# EAGLE design fusesBoard (EAGLE 7.6.0)
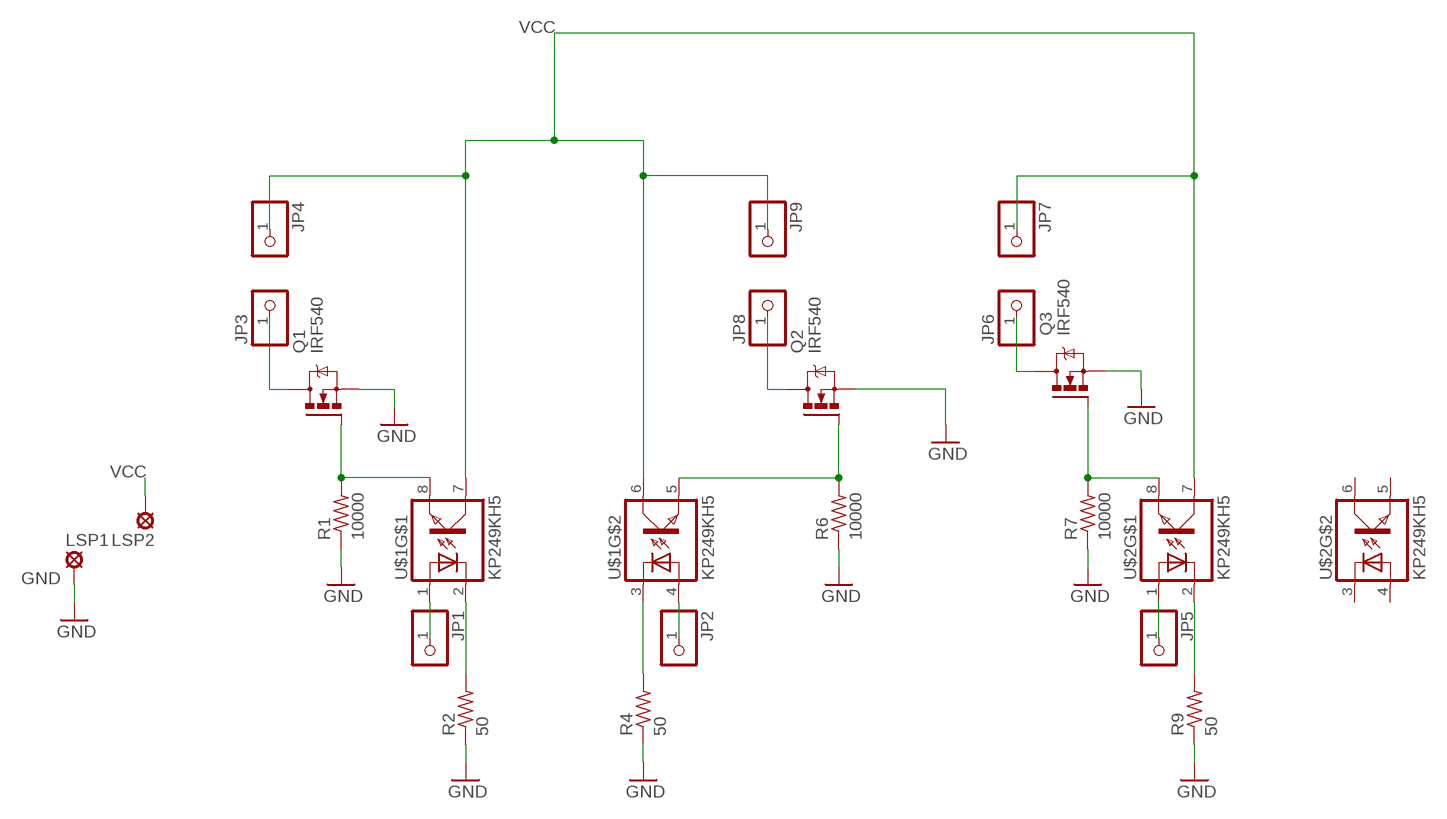
[diagram p0: schematic, sheet 1]

## Parts
JP1  PINHD-1X1  [1X01]
JP2  PINHD-1X1  [1X01]
JP3  PINHD-1X1  [1X01]
JP4  PINHD-1X1  [1X01]
JP5  PINHD-1X1  [1X01]
JP6  PINHD-1X1  [1X01]
JP7  PINHD-1X1  [1X01]
JP8  PINHD-1X1  [1X01]
JP9  PINHD-1X1  [1X01]
LSP1  SE14  [SE14]
LSP2  SE14  [SE14]
Q1  IRF540  [TO220BV]
Q2  IRF540  [TO220BV]
Q3  IRF540  [TO220BV]
R1  10000  R-US_0204/7  [0204/7]
R2  50  R-US_0204/7  [0204/7]
R4  50  R-US_0204/7  [0204/7]
R6  10000  R-US_0204/7  [0204/7]
R7  10000  R-US_0204/7  [0204/7]
R9  50  R-US_0204/7  [0204/7]
U$1  KP249KH5  [DIL08]
U$2  KP249KH5  [DIL08]

## Nets
CTRL1: JP1.1 U$1.1
CTRL2: JP2.1 U$1.4
CTRL3: JP5.1 U$2.1
GATE1: Q1.G R1.2 U$1.8
GATE2: Q2.G R6.2 U$1.5
GATE3: Q3.G R7.2 U$2.8
GND: LSP1.MP Q1.S Q2.S Q3.S R1.1 R2.1 R4.1 R6.1 R7.1 R9.1
N$17: R2.2 U$1.2
N$18: R9.2 U$2.2
N$26: R4.2 U$1.3
SOURCE1: JP3.1 Q1.D
SOURCE2: JP8.1 Q2.D
SOURCE3: JP6.1 Q3.D
VCC: JP4.1 JP7.1 JP9.1 LSP2.MP U$1.6 U$1.7 U$2.7
Unconnected: U$2.3 U$2.4 U$2.5 U$2.6

## Library data of the parts
JP1-JP9 = pinhead:PINHD-1X1: PIN HEADER
LSP1 LSP2 = solpad:SE14: SOLDER PAD E1553, drill 1,4mm, distributor Buerklin, 07F820
Q1-Q3 = transistor-power:IRF540: HEXFET Power MOSFET
R1 R2 R4 R6 R7 R9 = resistor:R-US_: RESISTOR, American symbol
U$1 U$2 = optron1:KP249KH5

## Board
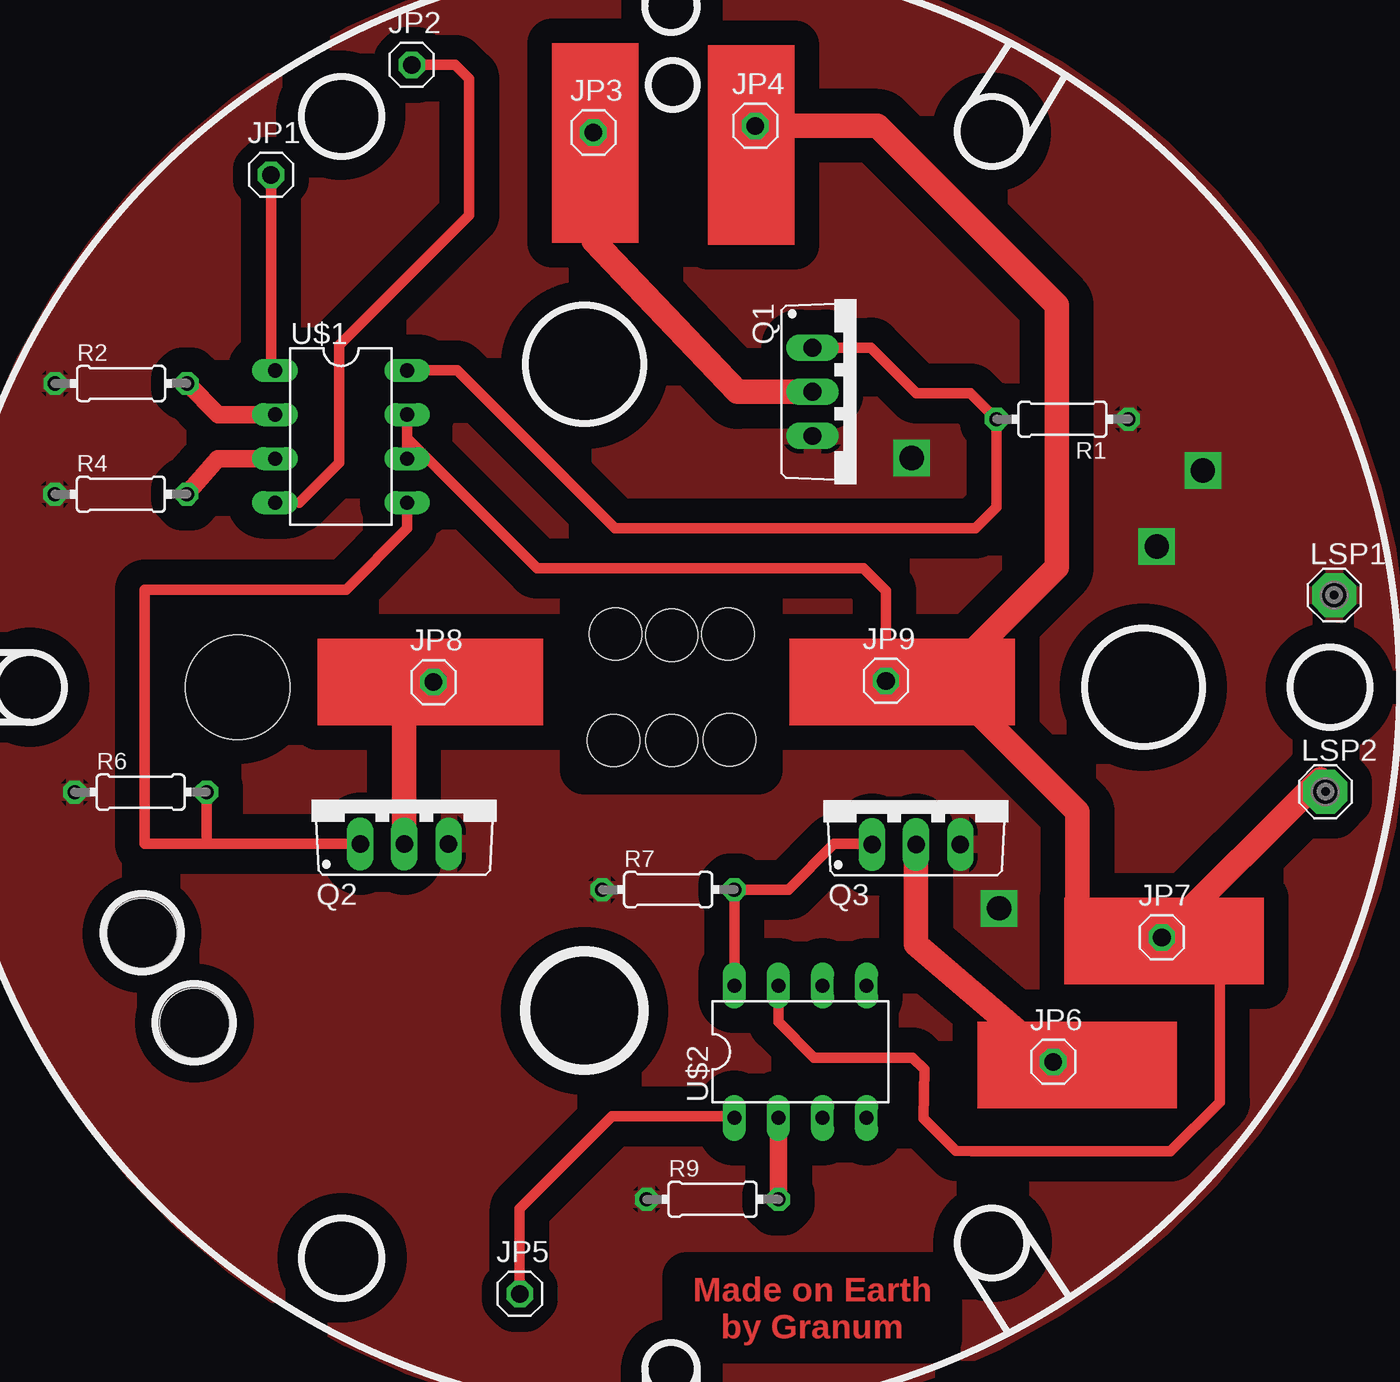
[diagram p1: board, top side]
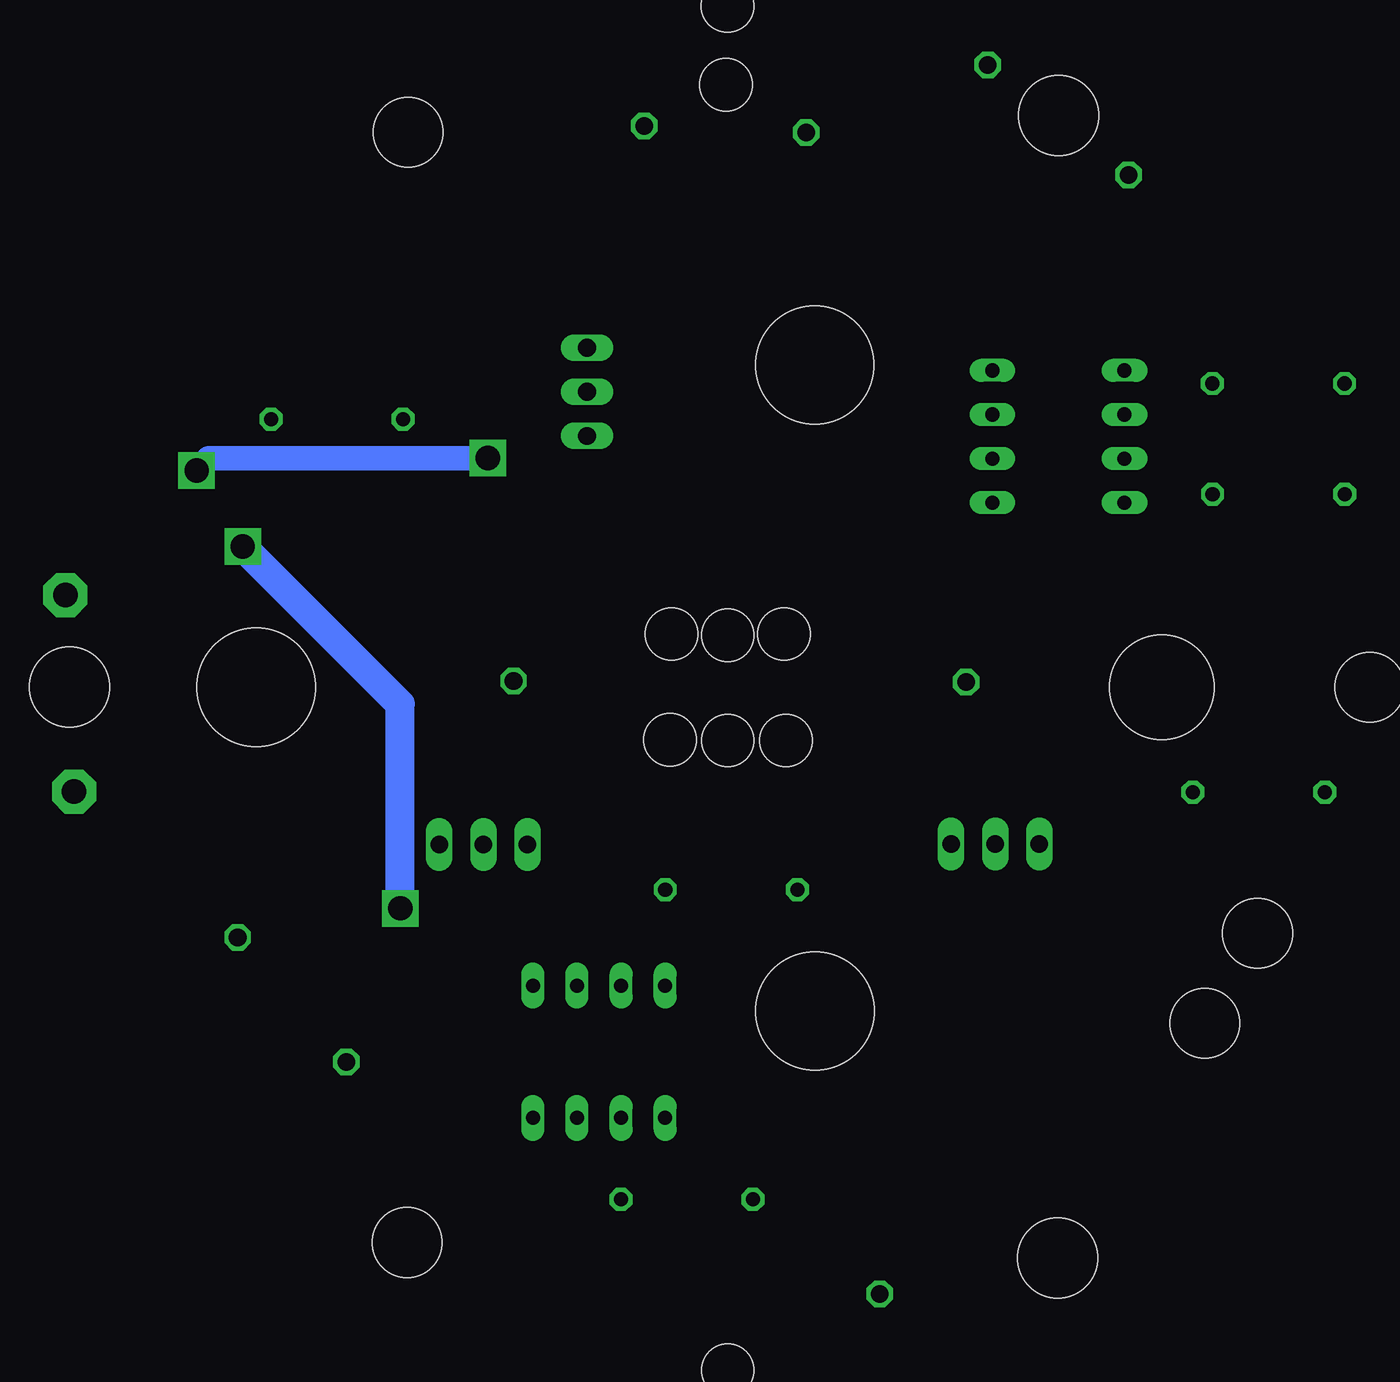
[diagram p2: board, bottom side, seen from below]

No outline drawn. Coordinates in mm, seen from the top.
Copper layers (1*16): Top 0.035mm / dielectric 1.5mm / Bottom 0.035mm
Design rules "default": minimum track width 10mil, minimum drill 24mil, track to track 8mil, track to pad 8mil, pad to pad 8mil, via to via 8mil, smd to smd 8mil, copper to edge 40mil, drill to drill 8mil, minimum pad ring 10mil, minimum via ring 8mil, stop-mask expansion 4mil, vias tented up to drill 0mil, thermal gap 10mil
Holes 6 mm at 20.01,40.12
Holes 6.8 mm at 40.03,58.69 72.25,40.11 40.01,21.45
Holes 4 mm at 8.02,40.12 63.48,72.11 63.55,8.1 14.49,25.92 17.52,20.75
Holes 4.6 mm at 25.95,73.09 83.02,40.12 26.03,7.22
Holes 3 mm at 45.04,0.74 45.06,79.39 45.14,74.86 41.8,43.19 48.29,43.19 41.68,37.05 48.37,37.09 45.04,37.05 45.04,43.11
tRestrict: area 40,41.4 to 50,44.9; area 40,35.4 to 50,38.9; area 43.9,66 to 46.4,81.8

### Footprints (pad centres in the part's own frame; a part is rotated, then mirrored left to right if it is on the bottom)
1X01 = drill 1.016 octagon: 1 0,0
SE14 = drill 1.397 pad 2.54 octagon: MP 0,0
TO220BV = drill 1.016 long: D 0,-2.54; G -2.54,-2.54; S 2.54,-2.54
0204/7 = drill 0.813 octagon: 1 -3.81,0; 2 3.81,0
DIL08 = drill 0.813 long: 1 -3.81,-3.81; 2 -1.27,-3.81; 3 1.27,-3.81; 4 3.81,-3.81; 5 3.81,3.81; 6 1.27,3.81; 7 -1.27,3.81; 8 -3.81,3.81

### Placement (x,y rotation side)
JP1  21.93,69.66 0 top
JP2  30.05,76 0 top
JP3  40.53,72.1 0 top
JP4  49.87,72.48 0 top
JP5  36.28,5.14 0 top
JP6  67.05,18.51 0 top
JP7  73.31,25.69 0 top
JP8  31.3,40.41 0 top
JP9  57.4,40.48 0 top
LSP1  83.25,45.43 0 top
LSP2  82.75,34.1 0 top
Q1  55.7,57.15 270 top
Q2  29.62,33.62 0 top
Q3  59.14,33.59 0 top
R1  67.58,55.57 180 top
R2  13.28,57.63 0 top
R4  13.27,51.24 0 top
R6  14.41,34.07 0 top
R7  44.84,28.45 0 top
R9  47.4,10.59 0 top
U$1  25.97,54.57 270 top
U$2  52.47,19.1 0 top

### Tracks (layer width: path | path; a pad name or v marks a point on that pad's centre or on a via)
CTRL1
  Top 0.406: U$1.1 arc-90 21.93,58.61
  Top 0.61: 21.93,58.61 JP1.1
CTRL2
  Top 0.406: U$1.4 23.55,50.76
  Top 0.61: 23.55,50.76 25.85,53.06 25.85,59.83 33.36,67.34 33.36,75.2 32.56,76 JP2.1
CTRL3
  Top 0.61: U$2.1 48.58,15.37 41.61,15.37 36.28,10.04 JP5.1
GATE1
  Top 0.61: Q1.G 56.54,59.69 59.17,57.06 62.28,57.06 R1.2 63.77,50.5 62.55,49.28 52.23,49.28 51.72,49.28 41.76,49.28 32.66,58.38 U$1.8
GATE2
  Top 0.406: R6.2
  Top 0.61: 18.21,31.08 14.65,31.08 14.65,45.75 26.25,45.75 29.78,49.28 U$1.5 | 18.21,31.08 Q2.G | R6.2 18.21,31.08
GATE3
  Top 0.61: U$2.8 R7.2 51.78,28.45 54.41,31.08 56.57,31.08 Q3.G
GND  (via drill 1.4)
  Bottom 0.61: v58.89,53.33 61.68,53.33
  Bottom 1.422: v58.89,53.33 74.97,53.33 v75.68,52.62
  Bottom 1.676: v63.93,27.37 63.93,39.14 v73.02,48.23
  pour Top (isolate 1.422): 3.42,40.51 arc-90 44.98,82.07 45.25,82.07 arc-90 87.05,40.27 87.05,39.96 arc-90 45.08,-2.01 44.98,-2.01 arc-90
N$17
  Top 1.016: R2.2 18.88,55.84 U$1.2
N$18
  Top 1.016: U$2.2 R9.2
N$26
  Top 1.016: R4.2 18.85,53.3 U$1.3
SOURCE1
  Top 1.422: Q1.D 48.84,57.15 40.53,65.87 JP3.1
SOURCE2
  Top 1.422: Q2.D 29.62,40.41 JP8.1
SOURCE3
  Top 1.422: Q3.D 59.14,25.3 JP6.1
VCC
  Top 0.406: 77.26,24.27 77.02,24.51 | 77.02,24.51 76.24,25.29 73.71,25.29 JP7.1 | 76.66,24.15 77.02,24.51 | U$1.7 29.78,54.46
  Top 0.61: U$2.7 51.2,20.82 53.26,18.76 58.94,18.76 59.62,18.08 59.57,15.26 61.44,13.39 62.36,13.35 73.81,13.35 76.66,16.2 76.66,24.15 | U$1.6 U$1.7 | 29.78,54.46 37.27,46.97 56.1,46.97 57.4,45.67 JP9.1
  Top 1.422: LSP2.MP 82.44,34.82 JP7.1 73.2,25.8 70.05,25.8 68.44,27.41 68.44,32.93 60.89,40.48 JP9.1 60.71,40.48 67.25,47.02 67.25,62.14 56.91,72.48 JP4.1
(copper drawn outside any net)
  shapes: Top area x6

### Text on the board
Top: Made on Earth / by Granum